# Altium schematic sheet Лист 1. Основной модуль. SchDoc.SchDoc
size 420 x 297 mm; SheetNumber: 1; SheetTotal: 3
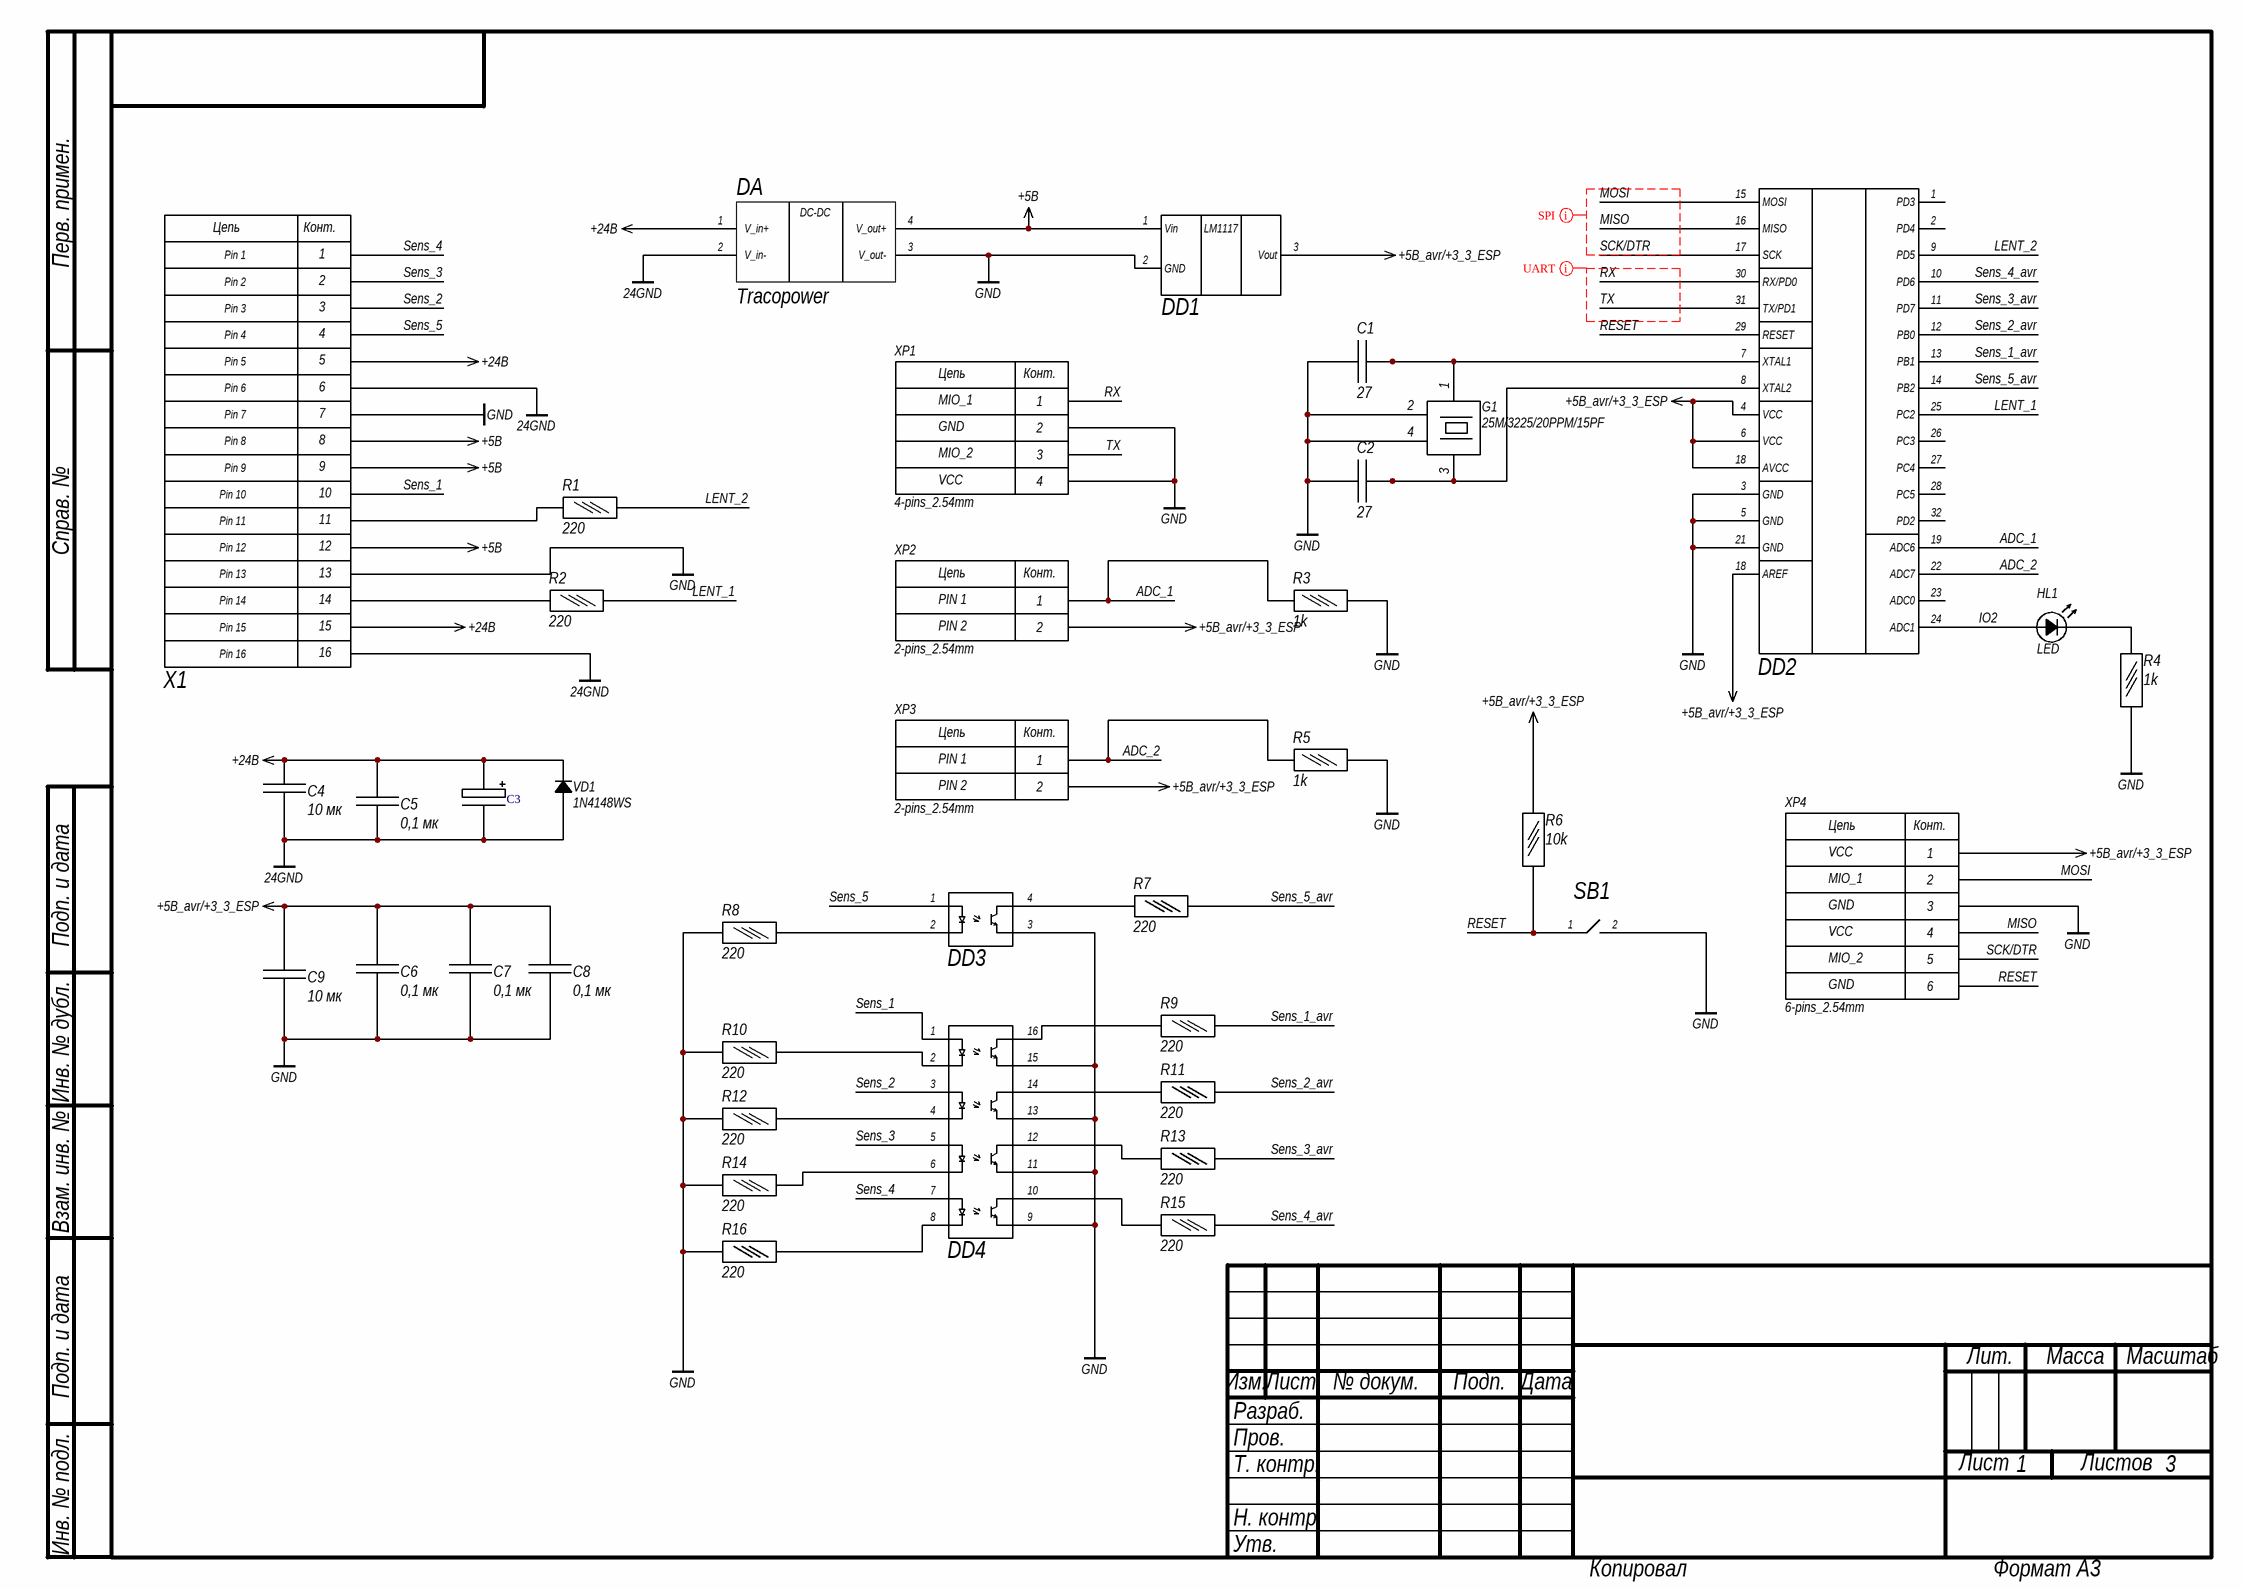
[diagram p0: Лист 1. Основной модуль. SchDoc.SchDoc]

## Parts
C1  value 27  [CAPC1608M]  (hidden comment: CC0603KRX7R8BB104 (0603 X7R 0,1uF 50V 10%)_1)
C2  value 27  [CAPC1608M]  (hidden comment: CC0603KRX7R8BB104 (0603 X7R 0,1uF 50V 10%)_1)
C3  CAP_SMD_POLAR  [CC_T491C476K016AT]  (value not drawn)
C4  value 10 мк  [CAPC1608M]  (hidden comment: CC0603KRX7R8BB104 (0603 X7R 0,1uF 50V 10%)_1)
C5  value 0,1 мк  [CAPC1608M]  (hidden comment: CC0603KRX7R8BB104 (0603 X7R 0,1uF 50V 10%)_1)
C6  value 0,1 мк  [CAPC1608M]  (hidden comment: CC0603KRX7R8BB104 (0603 X7R 0,1uF 50V 10%)_1)
C7  value 0,1 мк  [CAPC1608M]  (hidden comment: CC0603KRX7R8BB104 (0603 X7R 0,1uF 50V 10%)_1)
C8  value 0,1 мк  [CAPC1608M]  (hidden comment: CC0603KRX7R8BB104 (0603 X7R 0,1uF 50V 10%)_1)
C9  value 10 мк  [CAPC1608M]  (hidden comment: CC0603KRX7R8BB104 (0603 X7R 0,1uF 50V 10%)_1)
DA  Tracopower  [Tracopower]
DD1  LM1117  [SOT-223]  (value not drawn)
DD2  ATmega328p  [ATmega328P_TQFP]  (value not drawn)
DD3  IS-281  [IS-281]  (value not drawn)
DD4  IS-281-4  [SOIC16]  (value not drawn)
G1  25M/3225/20PPM/15PF  [EPSON TSX-3225]
HL1  LED  [LED 0603_1608 BLUE]
R1  value 220  [RESC1608M]  (hidden comment: RC0603FR-0710KL (0603 10k 1%))
R2  value 220  [RESC1608M]  (hidden comment: RC0603FR-0710KL (0603 10k 1%))
R3  value 1k  [RESC1608M]  (hidden comment: RC0603FR-071KL (0603 1k 1%))
R4  value 1k  [RESC1608M]  (hidden comment: RC0603FR-071KL (0603 1k 1%))
R5  value 1k  [RESC1608M]  (hidden comment: RC0603FR-071KL (0603 1k 1%))
R6  value 10k  [RESC1608M]  (hidden comment: RC0603FR-0710KL (0603 10k 1%))
R7  value 220  [RESC1608M]  (hidden comment: RC0603FR-0710KL (0603 10k 1%))
R8  value 220  [RESC1608M]  (hidden comment: RC0603FR-0710KL (0603 10k 1%))
R9  value 220  [RESC1608M]  (hidden comment: RC0603FR-0710KL (0603 10k 1%))
R10  value 220  [RESC1608M]  (hidden comment: RC0603FR-0710KL (0603 10k 1%))
R11  value 220  [RESC1608M]  (hidden comment: RC0603FR-0710KL (0603 10k 1%))
R12  value 220  [RESC1608M]  (hidden comment: RC0603FR-0710KL (0603 10k 1%))
R13  value 220  [RESC1608M]  (hidden comment: RC0603FR-0710KL (0603 10k 1%))
R14  value 220  [RESC1608M]  (hidden comment: RC0603FR-0710KL (0603 10k 1%))
R15  value 220  [RESC1608M]  (hidden comment: RC0603FR-0710KL (0603 10k 1%))
R16  value 220  [RESC1608M]  (hidden comment: RC0603FR-0710KL (0603 10k 1%))
SB1  Butt  [B3U1000P]  (value not drawn)
VD1  1N4148WS  [SOD-323]
X1  348269160  [348269160]  (value not drawn)
XP1  4-pins_2.54mm  [4pins_2.54]
XP2  2-pins_2.54mm  [2pins_2.54]
XP3  2-pins_2.54mm  [2pins_2.54]
XP4  6-pins_2.54mm  [6pins_2.54]

## Nets
24GND: C3.2 C4.2 C5.2 DA.2(V_in-) VD1.1(+) X1.6(Pin_6) X1.16(Pin_16)
+5В: DA.4(V_out+) DD1.1(Vin) X1.8(Pin_8) X1.9(Pin_9) X1.12(Pin_12)
+5В_avr/+3_3_ESP: C6.1 C7.1 C8.1 C9.1 DD1.3(Vout) DD2.4(VCC) DD2.6(VCC) DD2.18(AVCC) R6.2 XP2.2 XP3.2 XP4.1
+24В: C3.1 C4.1 C5.1 DA.1(V_in+) VD1.2(-) X1.5(Pin_5) X1.15(Pin_15)
GND: C1.1 C2.1 C6.2 C7.2 C8.2 C9.2 DA.3(V_out-) DD1.2(GND) DD2.3(GND) DD2.5(GND) DD2.21(GND) DD3.3 DD4.9 DD4.11 DD4.13 DD4.15 G1.2 G1.4 R3.1 R4.1 R5.1 R8.1 R10.1 R12.1 R14.1 R16.1 SB1.2 X1.7(Pin_7) X1.13(Pin_13) XP1.2 XP1.4 XP4.3
ADC_1: DD2.19(ADC6) R3.2 XP2.1
ADC_2: DD2.22(ADC7) R5.2 XP3.1
IO2: DD2.24(ADC1) HL1.1(A)
LENT_1: DD2.25(PC2) R2.2
LENT_2: DD2.9(PD5) R1.2
MISO: DD2.16(MISO) XP4.4
MOSI: DD2.15(MOSI) XP4.2
RESET: DD2.29(RESET) R6.1 SB1.1 XP4.6
RX: DD2.30(RX/PD0) XP1.1
SCK/DTR: DD2.17(SCK) XP4.5
Sens_1: DD4.1 X1.10(Pin_10)
Sens_1_avr: DD2.13(PB1) R9.2
Sens_2: DD4.3 X1.3(Pin_3)
Sens_2_avr: DD2.12(PB0) R11.2
Sens_3: DD4.5 X1.2(Pin_2)
Sens_3_avr: DD2.11(PD7) R13.2
Sens_4: DD4.7 X1.1(Pin_1)
Sens_4_avr: DD2.10(PD6) R15.2
Sens_5: DD3.1 X1.4(Pin_4)
Sens_5_avr: DD2.14(PB2) R7.2
TX: DD2.31(TX/PD1) XP1.3
NetC1_2: C1.2 DD2.7(XTAL1) G1.1(A)
NetC2_2: C2.2 DD2.8(XTAL2) G1.3
NetDD3_2: DD3.2 R8.2
NetDD3_4: DD3.4 R7.1
NetDD4_2: DD4.2 R10.2
NetDD4_4: DD4.4 R12.2
NetDD4_6: DD4.6 R14.2
NetDD4_8: DD4.8 R16.2
NetDD4_10: DD4.10 R15.1
NetDD4_12: DD4.12 R13.1
NetDD4_14: DD4.14 R11.1
NetDD4_16: DD4.16 R9.1
NetHL1_2: HL1.2(C) R4.2
NetR1_1: R1.1 X1.11(Pin_11)
NetR2_1: R2.1 X1.14(Pin_14)

Not connected (* = marked no-connect by the designer): DA 5; DD2 1(PD3) 2(PD4) 23(ADC0) 26(PC3) 27(PC4) 28(PC5) 32(PD2)

## Layout directives
net class UART: RX, TX
net class SPI: MISO, MOSI, SCK/DTR

## Notes on the sheet
- Перв. примен.
- Справ. №
- Подп. и дата
- Инв. № дубл.
- Взам. инв. №
- Разраб.
- Изм.
- Лист
- № докум.
- Подп.
- Дата
- Лит.
- Масса
- Масштаб
- Пров.
- Т. контр.
- Листов
- Инв. № подл.
- Н. контр.
- Утв.
- Копировал
- Формат А3
- (in symbol 2-pins_2.54mm) Цепь; Конт.; PIN 1; PIN 2
- (in symbol 4-pins_2.54mm) Цепь; Конт.; MIO_1; GND; MIO_2; VCC
- (in symbol 6-pins_2.54mm) Цепь; Конт.; VCC; MIO_1; GND; MIO_2
- (in symbol 348269160) Цепь; Конт.
- (in symbol TracoPower) DC-DC

## Library data of the parts
C1 C2 C4-C9 = CC0603KRX7R8BB104 (0603 X7R 0,1uF 50V 10%)_1: 0603 X7R 0,1uF 25V 10%; ValueManufacturerPartNumber: chip0603 X7R 0,1uF 50V 10%, CC0603KRX7R9BB104, Yageo; Capacitance,uF: 0.1 ±10%; Rated voltage, Vdc: 50; Component height, mm: 0.8; Gomponent weight, g: 0,007; Note: *; Size code in inch(mm): 0603 (1608M); Temperature characteristics: X7R; Operating temperature range,°С: -55...+125
C3 = CAP_SMD_POLAR: Отклонение от номинала: %; Ёмкость: *; Рабочее напряжение: *; Manufacturer: *; Part Number: *
DD2 = ATmega328p: 32 pins. SPI, UART, 4 CHANNELS ADC, 13 GPIO PORTS
G1 = 25M/3225/20PPM/15PF: 7B025000O01 Резонатор; ValueManufacturerPartNumber: 7B25000O01
HL1 = LED: Chip LED; ValueManufacturerPartNumber: Светодиод
R1 R2 R6-R16 = RC0603FR-0710KL (0603 10k 1%): chip0603 10k 1%; ValueManufacturerPartNumber: chip0603 10k 1%, RC0603FR-0710KL, Yageo; Номинальное сопротивление, кОм: 10; Допуск,%: 1; Мощность, Вт: 0,1; Тип корпуса: 0603; Рабочий диапазон температур,°С: -55...+155; Производитель: Yageo; Номинальное напряжение, В: 50; Максимально допустимое напряжение, В: 100; Примечание: *; Аналог: *
R3-R5 = RC0603FR-071KL (0603 1k 1%): chip0603 1k 1%; ValueManufacturerPartNumber: chip0603 1k 1%, RC0603FR-071KL, Yageo; Номинальное сопротивление, кОм: 1; Мощность, Вт: 0,1; Тип корпуса: 0603; Рабочий диапазон температур,°С: -55...+155; Производитель: Yageo; Номинальное напряжение, В: 50; Максимально допустимое напряжение, В: 100; Примечание: *; Допуск,%: 1; Аналог: *
VD1 = 1N4148WS: Chip DIOD 100В 150мА; ValueManufacturerPartNumber: 1N4148WS
XP1 = 4-pins_2.54mm: ValueManufacturerPartNumber: 4 pins
XP2 XP3 = 2-pins_2.54mm: ValueManufacturerPartNumber: 4 pins
XP4 = 6-pins_2.54mm: ValueManufacturerPartNumber: 4 pins